# Altium schematic sheet 17-INTERFACE.SchDoc: KARGOBOT-TBOX-V2.0
size 513 x 386 mm; Page Create Date: March  8, 1995; Page Number: 4; Page Size: C; Page Count: 81; RevCode: A; DsnPath: C:\Users\Administrator\Desktop\123\KARGOBOT-TCU-ORIN-V1.1.DSN; SchematicName: KARGOBT-TCU-ORIN-V1.1; PageName: N100; PageSize: C; TopSchematic: True
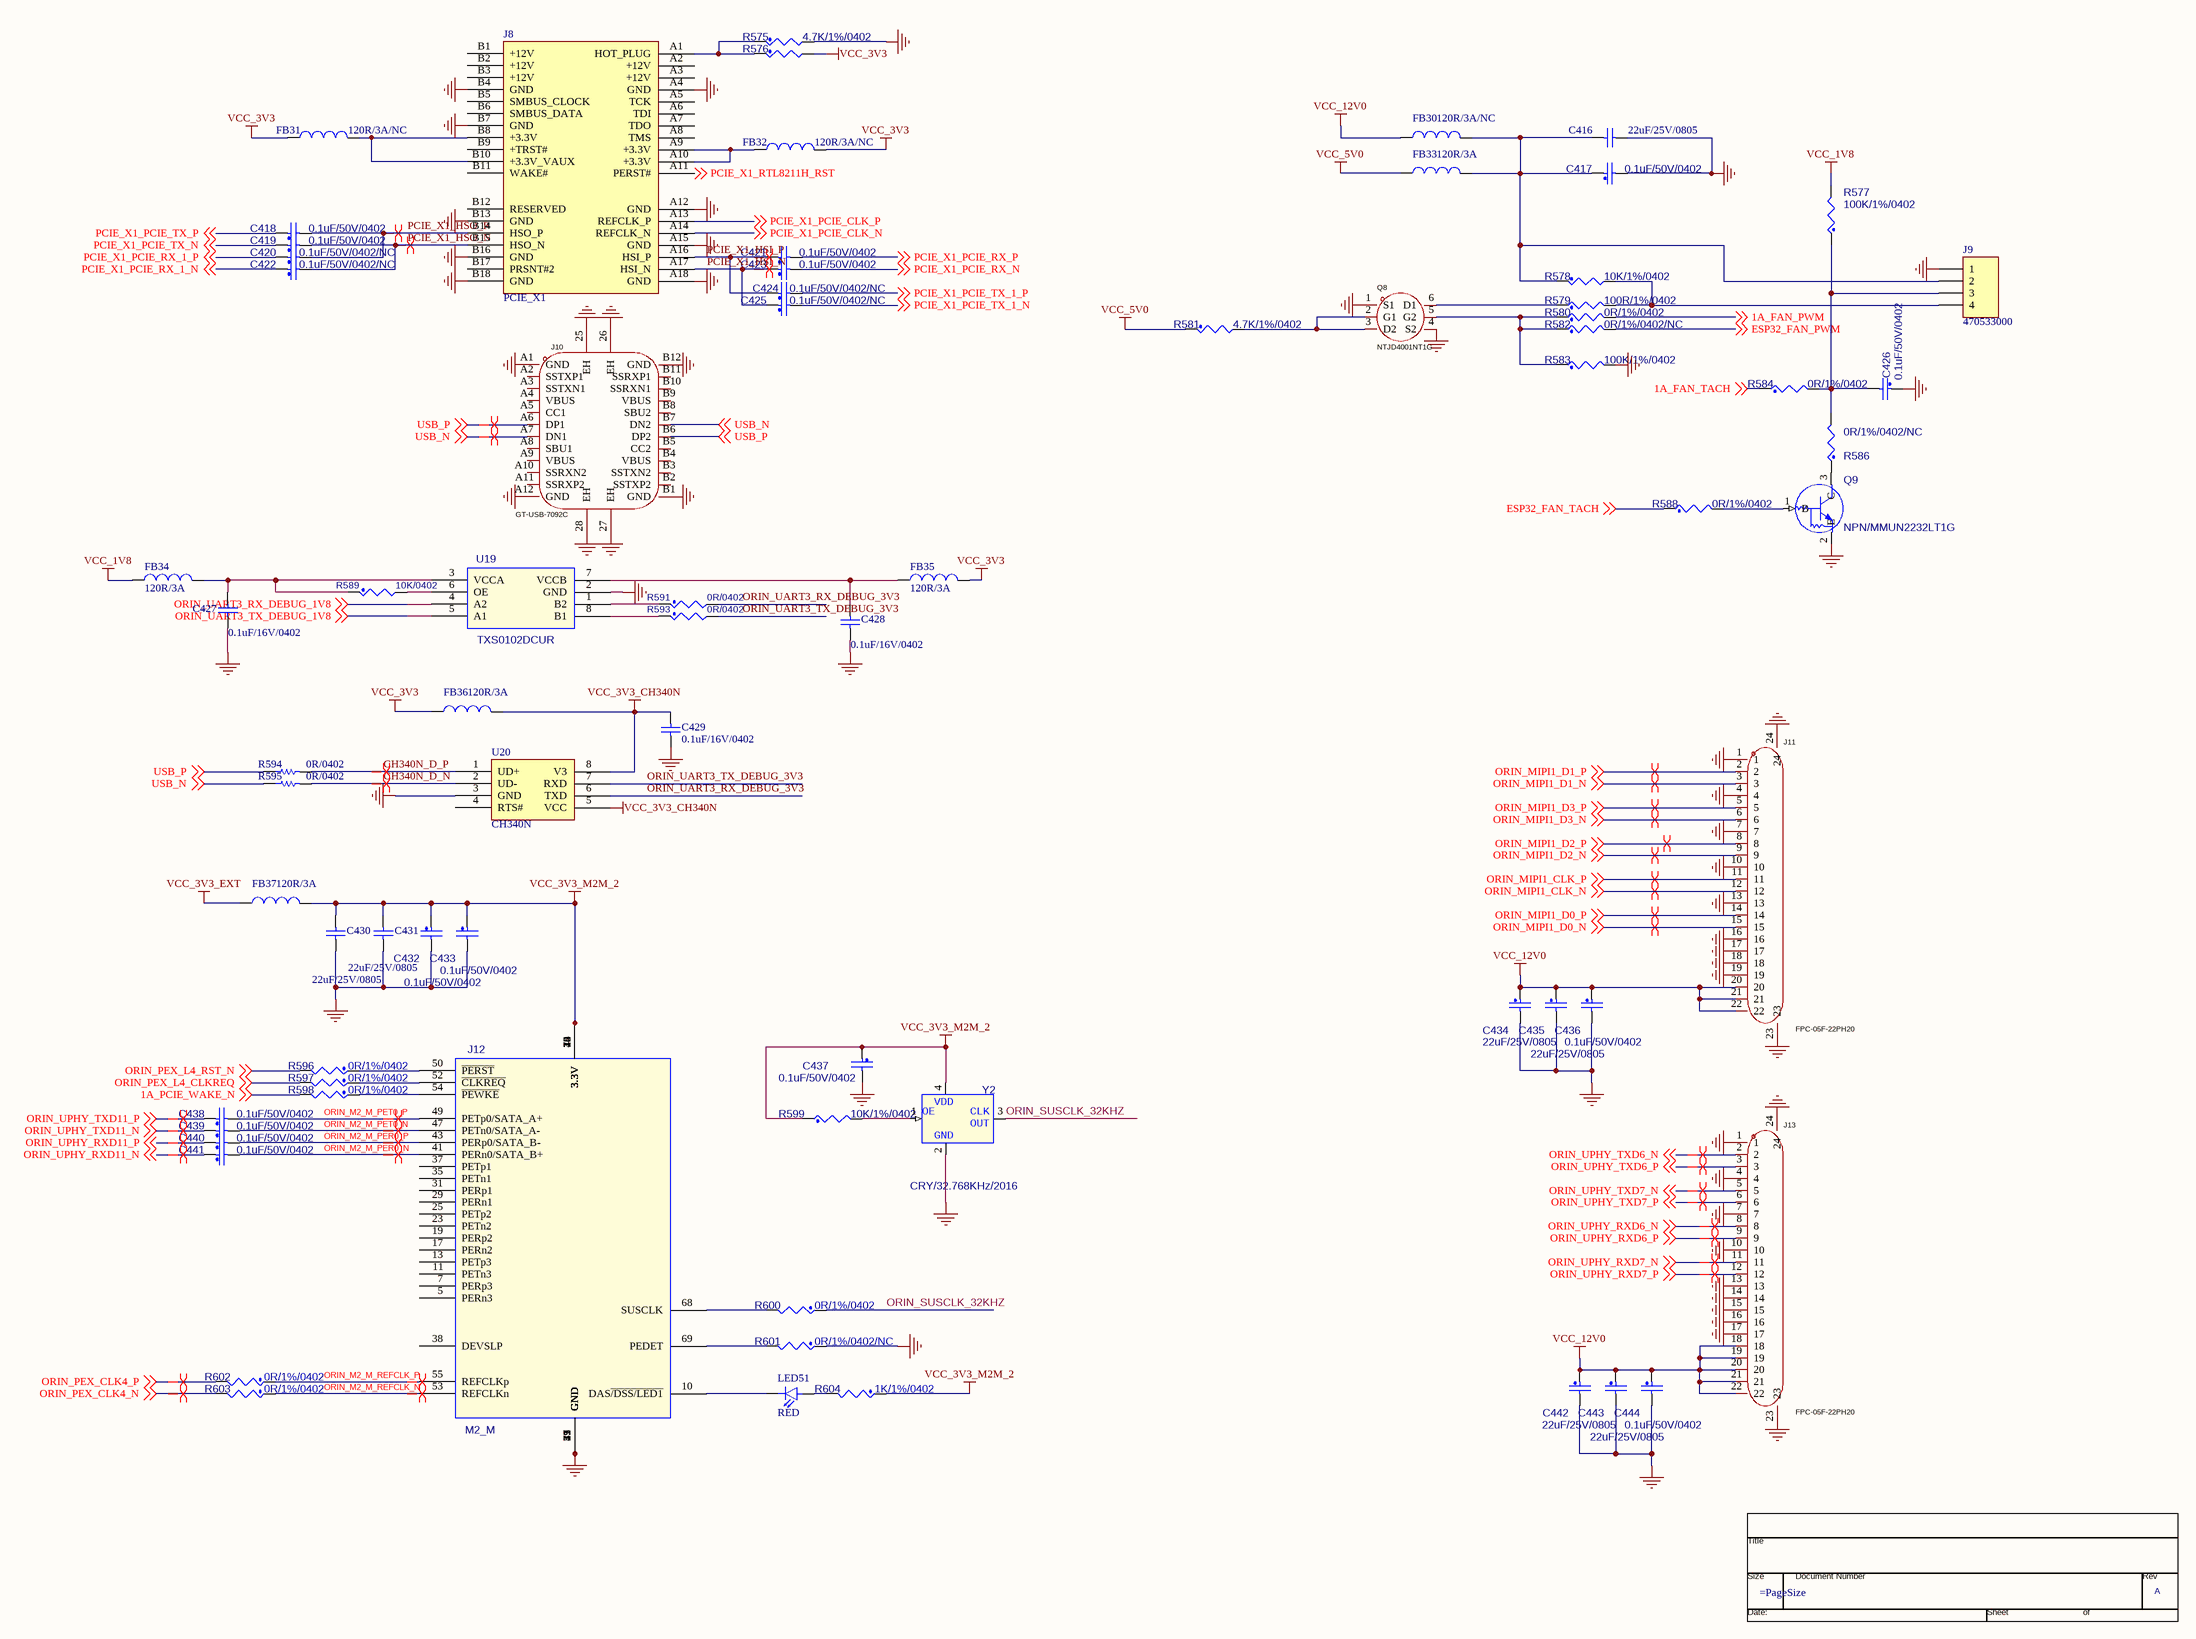
[diagram p0: 17-INTERFACE.SchDoc]

## Parts
*  RevCode: A  (graphical)
C416  22uF/25V/0805  [C0805]
C417  value 0.1uF/50V/0402  [C0402]  (hidden comment: CAP_NP)
C418  value 0.1uF/50V/0402  [C0402]  (hidden comment: CAP_NP)
C419  value 0.1uF/50V/0402  [C0402]  (hidden comment: CAP_NP)
C420  value 0.1uF/50V/0402/NC  [C0402]  (hidden comment: CAP_NP)
C421  value 0.1uF/50V/0402  [C0402]  (hidden comment: CAP_NP)
C422  value 0.1uF/50V/0402/NC  [C0402]  (hidden comment: CAP_NP)
C423  value 0.1uF/50V/0402  [C0402]  (hidden comment: CAP_NP)
C424  value 0.1uF/50V/0402/NC  [C0402]  (hidden comment: CAP_NP)
C425  value 0.1uF/50V/0402/NC  [C0402]  (hidden comment: CAP_NP)
C426  value 0.1uF/50V/0402  [C0402]  (hidden comment: CAP_NP)
C427  0.1uF/16V/0402  [C0402]
C428  0.1uF/16V/0402  [C0402]
C429  0.1uF/16V/0402  [C0402]
C430  22uF/25V/0805  [C0805]
C431  22uF/25V/0805  [C0805]
C432  value 0.1uF/50V/0402  [C0402]  (hidden comment: CAP_NP)
C433  value 0.1uF/50V/0402  [C0402]  (hidden comment: CAP_NP)
C434  value 22uF/25V/0805  [C0805]  (hidden comment: CAP_NP)
C435  value 22uF/25V/0805  [C0805]  (hidden comment: CAP_NP)
C436  value 0.1uF/50V/0402  [C0402]  (hidden comment: CAP_NP)
C437  0.1uF/50V/0402  [C0402]
C438  value 0.1uF/50V/0402  [C0402]  (hidden comment: CAP_NP)
C439  value 0.1uF/50V/0402  [C0402]  (hidden comment: CAP_NP)
C440  value 0.1uF/50V/0402  [C0402]  (hidden comment: CAP_NP)
C441  value 0.1uF/50V/0402  [C0402]  (hidden comment: CAP_NP)
C442  value 22uF/25V/0805  [C0805]  (hidden comment: CAP_NP)
C443  value 22uF/25V/0805  [C0805]  (hidden comment: CAP_NP)
C444  value 0.1uF/50V/0402  [C0402]  (hidden comment: CAP_NP)
FB30  120R/3A/NC  [L0603]
FB31  120R/3A/NC  [L0603]
FB32  120R/3A/NC  [L0603]
FB33  120R/3A  [L0603]
FB34  120R/3A  [L0603]
FB35  120R/3A  [L0603]
FB36  120R/3A  [L0603]
FB37  120R/3A  [L0603]
J8  PCIE_X1  [PCIeX16-GF-2D-1000-1K-O36]
J9  470533000  [470533000]
J10  GT-USB-7092C  [USB-C-SMD_GT-USB-7092C]
J11  FPC-05F-22PH20  [FPC-SMD_22P-P0.50_FPC-05F-22PH20]
J12  M2_M  [PCIe_M.2_Connectors_P=0.5mm_H=4.2mm_KeyM - 1]
J13  FPC-05F-22PH20  [FPC-SMD_22P-P0.50_FPC-05F-22PH20]
LED51  RED  [LED0603]
Q8  NTJD4001NT1G  [SOT-363_L2.0-W1.3-P0.65-LS2.1-TL]
Q9  NPN/MMUN2232LT1G  [SOT-23]
R575  value 4.7K/1%/0402  [R0402]  (hidden comment: RES_Dup2)
R576  RES_Dup2  [R0402]  (value not drawn)
R577  value 100K/1%/0402  [R0402]  (hidden comment: RES_Dup2)
R578  value 10K/1%/0402  [R0402]  (hidden comment: RES_Dup2)
R579  value 100R/1%/0402  [R0402]  (hidden comment: RES_Dup2)
R580  value 0R/1%/0402  [R0402]  (hidden comment: RES_Dup2)
R581  value 4.7K/1%/0402  [R0402]  (hidden comment: RES_Dup2)
R582  value 0R/1%/0402/NC  [R0402]  (hidden comment: RES_Dup2)
R583  value 100K/1%/0402  [R0402]  (hidden comment: RES_Dup2)
R584  value 0R/1%/0402  [R0402]  (hidden comment: RES_Dup2)
R586  value 0R/1%/0402/NC  [R0402]  (hidden comment: RES_Dup2)
R588  value 0R/1%/0402  [R0402]  (hidden comment: RES_Dup2)
R589  10K/0402  [R0402]
R591  0R/0402  [R0402]
R593  0R/0402  [R0402]
R594  0R/0402  [R0402]
R595  0R/0402  [R0402]
R596  value 0R/1%/0402  [R0402]  (hidden comment: RES_Dup2)
R597  value 0R/1%/0402  [R0402]  (hidden comment: RES_Dup2)
R598  value 0R/1%/0402  [R0402]  (hidden comment: RES_Dup2)
R599  10K/1%/0402  [R0402]
R600  value 0R/1%/0402  [R0402]  (hidden comment: RES_Dup2)
R601  value 0R/1%/0402/NC  [R0402]  (hidden comment: RES_Dup2)
R602  value 0R/1%/0402  [R0402]  (hidden comment: RES_Dup2)
R603  value 0R/1%/0402  [R0402]  (hidden comment: RES_Dup2)
R604  value 1K/1%/0402  [R0402]  (hidden comment: RES_Dup2)
U19  TXS0102DCUR  [VSSOP-8-TXS0102DCUR]
U20  CH340N  [SOP-8_L4.9-W3.9-P1.27-LS6.0-BL]
Y2  CRY/32.768KHz/2016  [CRY2016]

## Nets
GND: C416.1 C417.2 C426.1 C427.1 C428.1 C429.1 C430.1 C431.1 C432.2 C433.2 C434.2 C435.2 C436.2 C437.2 C442.2 C443.2 C444.2 J8.A4(GND) J8.A12(GND) J8.A15(GND) J8.A18(GND) J8.B4(GND) J8.B7(GND) J8.B13(GND) J8.B16(GND) J8.B18(GND) J9.1 J10.25(EH) J10.26(EH) J10.27(EH) J10.28(EH) J10.A1(GND) J10.A12(GND) J10.B1(GND) J10.B12(GND) J11.1 J11.4 J11.7 J11.10 J11.13 J11.16 J11.17 J11.18 J11.19 J11.23 J11.24 J12.1(GND) J12.3(GND) J12.9(GND) J12.15(GND) J12.21(GND) J12.27(GND) J12.33(GND) J12.39(GND) J12.45(GND) J12.51(GND) J12.57(GND) J12.71(GND) J12.73(GND) J12.75(GND) J13.1 J13.4 J13.7 J13.10 J13.13 J13.14 J13.15 J13.16 J13.17 J13.23 J13.24 Q8.1(S1) Q8.4(S2) Q9.2(E) R575.2 R583.2 R601.1 U19.2(GND) U20.3(GND) Y2.2(GND)
VCC_1V8: FB34.1 R577.2
VCC_3V3: FB31.1 FB32.2 FB35.2 FB36.1 R576.2
VCC_3V3_CH340N: C429.2 FB36.2 U20.5(VCC) U20.8(V3)
VCC_3V3_EXT: FB37.1
VCC_3V3_M2M_2: C430.2 C431.2 C432.1 C433.1 C437.1 FB37.2 J12.2(3.3V) J12.4(3.3V) J12.12(3.3V) J12.14(3.3V) J12.16(3.3V) J12.18(3.3V) J12.70(3.3V) J12.72(3.3V) J12.74(3.3V) R599.1 R604.1 Y2.4(VDD)
VCC_5V0: FB33.1 R581.1
VCC_12V0: C434.1 C435.1 C436.1 C442.1 C443.1 C444.1 FB30.1 J11.20 J11.21 J11.22 J13.18 J13.19 J13.20 J13.21 J13.22
1A_FAN_PWM: R580.2 ; off-sheet 1A_FAN_PWM
1A_FAN_TACH: R584.1 ; off-sheet 1A_FAN_TACH
1A_PCIE_WAKE_N: R598.2 ; off-sheet 1A_PCIE_WAKE_N
CH340N_D_N: R595.2 U20.2(UD-)
CH340N_D_P: R594.2 U20.1(UD+)
ESP32_FAN_PWM: R582.2 ; off-sheet ESP32_FAN_PWM
ESP32_FAN_TACH: R588.1 ; off-sheet ESP32_FAN_TACH
ORIN_M2_M_PER0_N: C441.2 J12.41(PERn0/SATA_B+)
ORIN_M2_M_PER0_P: C440.2 J12.43(PERp0/SATA_B-)
ORIN_M2_M_PET0_N: C439.2 J12.47(PETn0/SATA_A-)
ORIN_M2_M_PET0_P: C438.2 J12.49(PETp0/SATA_A+)
ORIN_M2_M_REFCLK_N: J12.53(REFCLKn) R603.1
ORIN_M2_M_REFCLK_P: J12.55(REFCLKp) R602.1
ORIN_MIPI1_CLK_N: J11.12 ; off-sheet ORIN_MIPI1_CLK_N
ORIN_MIPI1_CLK_P: J11.11 ; off-sheet ORIN_MIPI1_CLK_P
ORIN_MIPI1_D0_N: J11.15 ; off-sheet ORIN_MIPI1_D0_N
ORIN_MIPI1_D0_P: J11.14 ; off-sheet ORIN_MIPI1_D0_P
ORIN_MIPI1_D1_N: J11.3 ; off-sheet ORIN_MIPI1_D1_N
ORIN_MIPI1_D1_P: J11.2 ; off-sheet ORIN_MIPI1_D1_P
ORIN_MIPI1_D2_N: J11.9 ; off-sheet ORIN_MIPI1_D2_N
ORIN_MIPI1_D2_P: J11.8 ; off-sheet ORIN_MIPI1_D2_P
ORIN_MIPI1_D3_N: J11.6 ; off-sheet ORIN_MIPI1_D3_N
ORIN_MIPI1_D3_P: J11.5 ; off-sheet ORIN_MIPI1_D3_P
ORIN_PEX_CLK4_N: R603.2 ; off-sheet ORIN_PEX_CLK4_N
ORIN_PEX_CLK4_P: R602.2 ; off-sheet ORIN_PEX_CLK4_P
ORIN_PEX_L4_CLKREQ: R597.2 ; off-sheet ORIN_PEX_L4_CLKREQ
ORIN_PEX_L4_RST_N: R596.2 ; off-sheet ORIN_PEX_L4_RST_N
ORIN_SUSCLK_32KHZ: R600.1 Y2.3(CLKOUT)
ORIN_UART3_RX_DEBUG_1V8: U19.4(A2) ; off-sheet ORIN_UART3_RX_DEBUG_1V8
ORIN_UART3_RX_DEBUG_3V3: R591.2 U20.6(TXD)
ORIN_UART3_TX_DEBUG_1V8: U19.5(A1) ; off-sheet ORIN_UART3_TX_DEBUG_1V8
ORIN_UART3_TX_DEBUG_3V3: R593.2 U20.7(RXD)
ORIN_UPHY_RXD6_N: J13.8 ; off-sheet ORIN_UPHY_RXD6_N
ORIN_UPHY_RXD6_P: J13.9 ; off-sheet ORIN_UPHY_RXD6_P
ORIN_UPHY_RXD7_N: J13.11 ; off-sheet ORIN_UPHY_RXD7_N
ORIN_UPHY_RXD7_P: J13.12 ; off-sheet ORIN_UPHY_RXD7_P
ORIN_UPHY_RXD11_N: C441.1 ; off-sheet ORIN_UPHY_RXD11_N
ORIN_UPHY_RXD11_P: C440.1 ; off-sheet ORIN_UPHY_RXD11_P
ORIN_UPHY_TXD6_N: J13.2 ; off-sheet ORIN_UPHY_TXD6_N
ORIN_UPHY_TXD6_P: J13.3 ; off-sheet ORIN_UPHY_TXD6_P
ORIN_UPHY_TXD7_N: J13.5 ; off-sheet ORIN_UPHY_TXD7_N
ORIN_UPHY_TXD7_P: J13.6 ; off-sheet ORIN_UPHY_TXD7_P
ORIN_UPHY_TXD11_N: C439.1 ; off-sheet ORIN_UPHY_TXD11_N
ORIN_UPHY_TXD11_P: C438.1 ; off-sheet ORIN_UPHY_TXD11_P
PCIE_X1_HSI_N: C423.1 C425.1 J8.A17(HSI_N)
PCIE_X1_HSI_P: C421.1 C424.1 J8.A16(HSI_P)
PCIE_X1_HSO_N: C419.2 C422.2 J8.B15(HSO_N)
PCIE_X1_HSO_P: C418.2 C420.2 J8.B14(HSO_P)
PCIE_X1_PCIE_CLK_N: J8.A14(REFCLK_N) ; off-sheet PCIE_X1_PCIE_CLK_N
PCIE_X1_PCIE_CLK_P: J8.A13(REFCLK_P) ; off-sheet PCIE_X1_PCIE_CLK_P
PCIE_X1_PCIE_RX_1_N: C422.1 ; off-sheet PCIE_X1_PCIE_RX_1_N
PCIE_X1_PCIE_RX_1_P: C420.1 ; off-sheet PCIE_X1_PCIE_RX_1_P
PCIE_X1_PCIE_RX_N: C423.2 ; off-sheet PCIE_X1_PCIE_RX_N
PCIE_X1_PCIE_RX_P: C421.2 ; off-sheet PCIE_X1_PCIE_RX_P
PCIE_X1_PCIE_TX_1_N: C425.2 ; off-sheet PCIE_X1_PCIE_TX_1_N
PCIE_X1_PCIE_TX_1_P: C424.2 ; off-sheet PCIE_X1_PCIE_TX_1_P
PCIE_X1_PCIE_TX_N: C419.1 ; off-sheet PCIE_X1_PCIE_TX_N
PCIE_X1_PCIE_TX_P: C418.1 ; off-sheet PCIE_X1_PCIE_TX_P
PCIE_X1_RTL8211H_RST: J8.A11(PERST#) ; off-sheet PCIE_X1_RTL8211H_RST
USB_N: J10.A7(DN1) J10.B7(DN2) R595.1 ; off-sheet USB_N
USB_P: J10.A6(DP1) J10.B6(DP2) R594.1 ; off-sheet USB_P
NetC416_2: C416.2 C417.1 FB30.2 FB33.2 J9.2 R578.1
NetC426_2: C426.2 J9.3 R577.1 R584.2 R586.2
NetC427_2: C427.2 FB34.2 R589.1 U19.3(VCCA)
NetC428_2: C428.2 FB35.1 U19.7(VCCB)
NetFB31_2: FB31.2 J8.B8(+3.3V) J8.B10(+3.3V_VAUX)
NetFB32_1: FB32.1 J8.A9(+3.3V) J8.A10(+3.3V)
NetJ8_A1: J8.A1(HOT_PLUG) R575.1 R576.1
NetJ9_4: J9.4 R578.2 R579.2
NetJ12_10: J12.10(DAS~{/DSS/LED1}) LED51.2
NetJ12_50: J12.50(~{PERST}) R596.1
NetJ12_52: J12.52(~{CLKREQ}) R597.1
NetJ12_54: J12.54(~{PEWKE}) R598.1
NetJ12_68: J12.68(SUSCLK) R600.2
NetJ12_69: J12.69(PEDET) R601.2
NetLED51_1: LED51.1 R604.2
NetQ8_2: Q8.2(G1) Q8.3(D2) R581.2
NetQ8_5: Q8.5(G2) R580.1 R582.1 R583.1
NetQ8_6: Q8.6(D1) R579.1
NetQ9_1: Q9.1(B) R588.2
NetQ9_3: Q9.3(C) R586.1
NetR589_2: R589.2 U19.6(OE)
NetR591_1: R591.1 U19.1(B2)
NetR593_1: R593.1 U19.8(B1)
NetR599_2: R599.2 Y2.1(OE)

Not connected (* = marked no-connect by the designer): J8 A2(+12V) A3(+12V) A5(TCK) A6(TDI) A7(TDO) A8(TMS) B1(+12V) B2(+12V) B3(+12V) B5(SMBUS_CLOCK) B6(SMBUS_DATA) B9(+TRST#) B11(WAKE#) B12(RESERVED) B17(PRSNT#2); J10 A2(SSTXP1) A3(SSTXN1) A4(VBUS) A5(CC1) A8(SBU1) A9(VBUS) A10(SSRXN2) A11(SSRXP2) B2(SSTXP2) B3(SSTXN2) B4(VBUS) B5(CC2) B8(SBU2) B9(VBUS) B10(SSRXN1) B11(SSRXP1); J12 5(PERn3) 7(PERp3) 11(PETn3) 13(PETp3) 17(PERn2) 19(PERp2) 23(PETn2) 25(PETp2) 29(PERn1) 31(PERp1) 35(PETn1) 37(PETp1) 38(DEVSLP); U20 4(RTS#)

## Layout directives
differential pair: CH340N_D_N, CH340N_D_P, ORIN_M2_M_PER0_N, ORIN_M2_M_PER0_P, ORIN_M2_M_PET0_N, ORIN_M2_M_PET0_P, ORIN_M2_M_REFCLK_N, ORIN_M2_M_REFCLK_P, ORIN_MIPI1_CLK_N, ORIN_MIPI1_CLK_P, ORIN_MIPI1_D0_N, ORIN_MIPI1_D0_P, ORIN_MIPI1_D1_N, ORIN_MIPI1_D1_P, ORIN_MIPI1_D2_N, ORIN_MIPI1_D2_P, ORIN_MIPI1_D3_N, ORIN_MIPI1_D3_P, ORIN_PEX_CLK4_N, ORIN_PEX_CLK4_P, ORIN_UPHY_RXD6_N, ORIN_UPHY_RXD6_P, ORIN_UPHY_RXD7_N, ORIN_UPHY_RXD7_P, ORIN_UPHY_RXD11_N, ORIN_UPHY_RXD11_P, ORIN_UPHY_TXD6_N, ORIN_UPHY_TXD6_P, ORIN_UPHY_TXD7_N, ORIN_UPHY_TXD7_P, ORIN_UPHY_TXD11_N, ORIN_UPHY_TXD11_P, PCIE_X1_HSI_N, PCIE_X1_HSI_P, PCIE_X1_HSO_N, PCIE_X1_HSO_P, USB_N, USB_P

## Notes on the sheet
- (in symbol CLKGEN-SM) CLK; OUT
- (in symbol TitleBlock0) Title; Size; Document Number; Rev; Date:; Sheet; of

## Library data of the parts
* = TitleBlock0: Page Count: 81; Page Number: 4; Title: KARGOBOT-TBOX-V2.0; Page Size: =PageSize; Page Create Date: March  8, 1995; Page Modify Date: =ModifiedDate
C416 C427-C431 = CAP: Capacitor; Value: 100pF; Published: 8-Jun-2000; Revision: July-2002: Re-released for DXP Platform.; Publisher: Altium Limited
C417-C426 C432 C433 C436 C438-C441 C444 = CAP_NP: GCM155R71H104KE02/MURATA; Part Reference: C15; CLASS: DISCRETE; FPLIST: CC0402_25,CC0402_HD,CC0402_CC; CAD_APPROVED: Yes; MFG_PN01: 0402YC104KAT2A; MFG_NAME01: AVX; Tolerance: 10%; AGILE_PN: 150-75182; VOLTAGE: 16V; HEIGHT: 0.635MM; ROHS: Yes; TOL: 10%; PCB Footprint: C0402
C434 C435 C442 C443 = CAP_NP: GRT31CC71E226ME13/MURATA; Part Reference: C13; CLASS: DISCRETE; VOLTAGE: 10v; CAD_APPROVED: Yes; MFG_PN01: C1608X5R1A106K; MFG_NAME01: TDK; TOL: 10%; AGILE_PN: 150-78675; FPLIST: CC0603_OV,CC0603,0603_CC; PCB Footprint: C1206; HEIGHT: 1.016MM; ROHS: Yes; Tolerance: 10%
C437 = CAP_NP_Dup1: GCM155R71H104KE02/MURATA; Part Reference: C38; CLASS: DISCRETE; Value: 0.1uF/50V/0402; PCB Footprint: C0402
FB30-FB37 = Inductor: BLM18KG121TN1D; Code_IEC: 1005; Value: 10mH; Published: 8-Jun-2000; LatestRevisionDate: 29-May-2009; LatestRevisionNote: IPC-7351 Footprint Added.; PackageReference: 0402-A; Publisher: Altium Limited; PackageDescription: Chip Inductor; Code_JEITA: 0402
J9 = Header 4: Header, 4-Pin; LatestRevisionDate: 17-Jul-2002; LatestRevisionNote: Re-released for DXP Platform.; Publisher: Altium Limited
J10 = GT-USB-7092C: Manufacturer: G-Switch(品赞); Add into BOM: yes; Connector Type: Type-C; Gender: 母; Number of Contacts: 24P; Number of Ports: 1; Current Rating - Power (Max): 5A; Rated Voltage (Max): 24V; Connect-Disconnect Life: 1万次; Center Height: 7.2mm; Core Colour: 黑色; Symbol: GT-USB-7092C; Device: GT-USB-7092C; LCSC Part Name: Type-C 母 侧贴; Supplier Part: C22471968; Manufacturer Part: GT-USB-7092C; Supplier Footprint: SMD; JLCPCB Part Class: Extended Part; Datasheet: https://atta.szlcsc.com/upload/public/pdf/source/20240624/0752ADA6134B10077FCDD9A2DA872EFC.pdf; Supplier: LCSC; Convert to PCB: yes; Standard: USB 3.1; Mounting Style: 侧贴; Length: 13.9mm; Operating Temperature Range: -40℃~+85℃; Comment_1: GT-USB-7092C
J11 J13 = FPC-05F-22PH20: Manufacturer: XUNPU(讯普); Add into BOM: yes; Locking Feature: 翻盖式; Number of Contacts: 22P; Pitch: 0.5mm; FFC, FCB Thickness: 0.3mm; Symbol: FPC-05F-22PH20; Device: FPC-05F-22PH20; LCSC Part Name: 间距:0.5mm P数:22P 翻盖式 下接; Supplier Part: C2856804; Manufacturer Part: FPC-05F-22PH20; Supplier Footprint: SMD,P=0.5mm,卧贴; JLCPCB Part Class: Extended Part; Datasheet: https://atta.szlcsc.com/upload/public/pdf/source/20210922/C2856804_675295370E4BEA18823604D875A4450B.pdf; Supplier: LCSC; Convert to PCB: yes; Contact Type: 下接; Mounting Type: 卧贴; Height Above Board: 2mm; Operating Temperature Range: -25℃~+85℃; Comment_1: FPC-05F-22PH20
J12 = M2_M: Part Reference: J2; PCB Footprint: M2_M; Value: M2_M
LED51 = LED
Q8 = NTJD4001NT1G: Manufacturer: onsemi(安森美); Add into BOM: yes; Type: 2个N沟道; Drain Source Voltage (Vdss): 30V; Continuous Drain Current (Id): 250mA; Drain Source On Resistance (RDS(on)@Vgs,Id): 1Ω@4.0V,10mA; Power Dissipation (Pd): 272mW; Gate Threshold Voltage (Vgs(th)@Id): 1.2V@100uA; Total Gate Charge (Qg@Vgs): 1.3nC@5.0V; Input Capacitance (Ciss@Vds): 33pF; Reverse Transfer Capacitance (Crss@Vds): 12pF; Symbol: NTJD4001NT1G; Device: NTJD4001NT1G; LCSC Part Name: 2个N沟道 耐压:30V 电流:250mA; Supplier Part: C190019; Manufacturer Part: NTJD4001NT1G; Supplier Footprint: SOT-363; JLCPCB Part Class: Extended Part; Datasheet: https://atta.szlcsc.com/upload/public/pdf/source/20221020/BF1533DEA35874F4C3E9C060B4E2CFE5.pdf; Supplier: LCSC; Convert to PCB: yes; Operating Temperature: -55℃~+150℃; Comment_1: NTJD4001NT1G
Q9 = DTC143ZE: MMUN2232LT1G/ONSEMI; Part Reference: Q1; Value: NPN/MMUN2232LT1G; PCB Footprint: SOT-23
R575 R576 R578 R581 = RES_Dup2: AC0402FR-074K7L/YAGEO; Part Reference: R7982; CLASS: DISCRETE; TOL: 5%; AGILE_PN: 470-75626; MFG_NAME01: KOA SPEER; MFG_PN01: RK73B1ETTP472J; CAD_APPROVED: Yes; FPLIST: RC0402_25,RC0402_HD,RC0402_CC; HEIGHT: 0.41mm; Tolerance: 5%; ROHS: Yes; PCB Footprint: R0402
R577 R579 R580 R582-R584 R586 R588 = RES_Dup2: AC0402FR-070RL/YAGEO; Part Reference: R179; CLASS: DISCRETE; SIGNAL_MODEL: DEFAULT_RESISTOR_33.000000OHM_2_1; FPLIST: RC0603_OV; CAD_APPROVED: Yes; MFG_PN01: CR-02FL6---33R; MFG_NAME01: YAGEO; Tolerance: 1%; AGILE_PN: 470-75790; TOL: 5%; ROHS: Yes; HEIGHT: 0.4MM; PCB Footprint: R0402
R589 R591 R593 = RES_Dup1: RES MF 1.0K 1/16W 5% 0402; CLASS: DISCRETE; AGILE_PN: 470-75555; MFG_NAME01: VISHAY INTERTECHNOLOGY; MFG_PN01: CRCW04021K00JNED; CAD_APPROVED: Yes; FPLIST: RC0402_25,RC0402_HD,RC0402_CC; HEIGHT: 0.41mm; TOL: 5%; Tolerance: 5%; ROHS: Yes
R594 R595 = Res Semi: Semiconductor Resistor; Value: 240R; Published: 8-Jun-2000; LatestRevisionDate: 17-Jul-2002; LatestRevisionNote: Re-released for DXP Platform.; PackageReference: AXIAL-0.5; Publisher: Altium Limited; PackageDescription: Axial Device, Thru-Hole; 2 Leads; 0.5 in Pin Spacing
R596-R598 R600-R604 = RES_Dup2: AC0402FR-070RL/YAGEO; Part Reference: R97; CLASS: DISCRETE; SIGNAL_MODEL: DEFAULT_RESISTOR_33.000000OHM_2_1; FPLIST: RC0603_OV; CAD_APPROVED: Yes; MFG_PN01: CR-02FL6---33R; MFG_NAME01: YAGEO; Tolerance: 1%; AGILE_PN: 470-75790; TOL: 5%; ROHS: Yes; HEIGHT: 0.4MM; PCB Footprint: R0402
R599 = RES_0: AC0402FR-0710KL/YAGEO; Part Reference: R55; CLASS: DISCRETE; Value: 10K/1%/0402; PCB Footprint: R0402
U19 = TXS0102DCUR: TXS0102DCUR/TI; Part Reference: U12; PCB Footprint: VSSOP8-TXS0102DCUR; Value: TXS0102DCUR
Y2 = CLKGEN-SM: SX1M32.768KM10F30TNN/SCTF; Part Reference: Y1; CLASS: IC; Value: CRY/32.768KHz/2016; PCB Footprint: CRY2016